# EasyEDA Pro project ProPrj_rrnje_2026-06-12.epro

# Schematic Schematic1
Board Name: Board1; Create Date: 2026-06-07; Page Name: P1; Project Name: cube; Schematic Name: Schematic1; Update Date: 2026-06-07; Company: EasyEDA.com; Page Size: A4; Version: V1.0
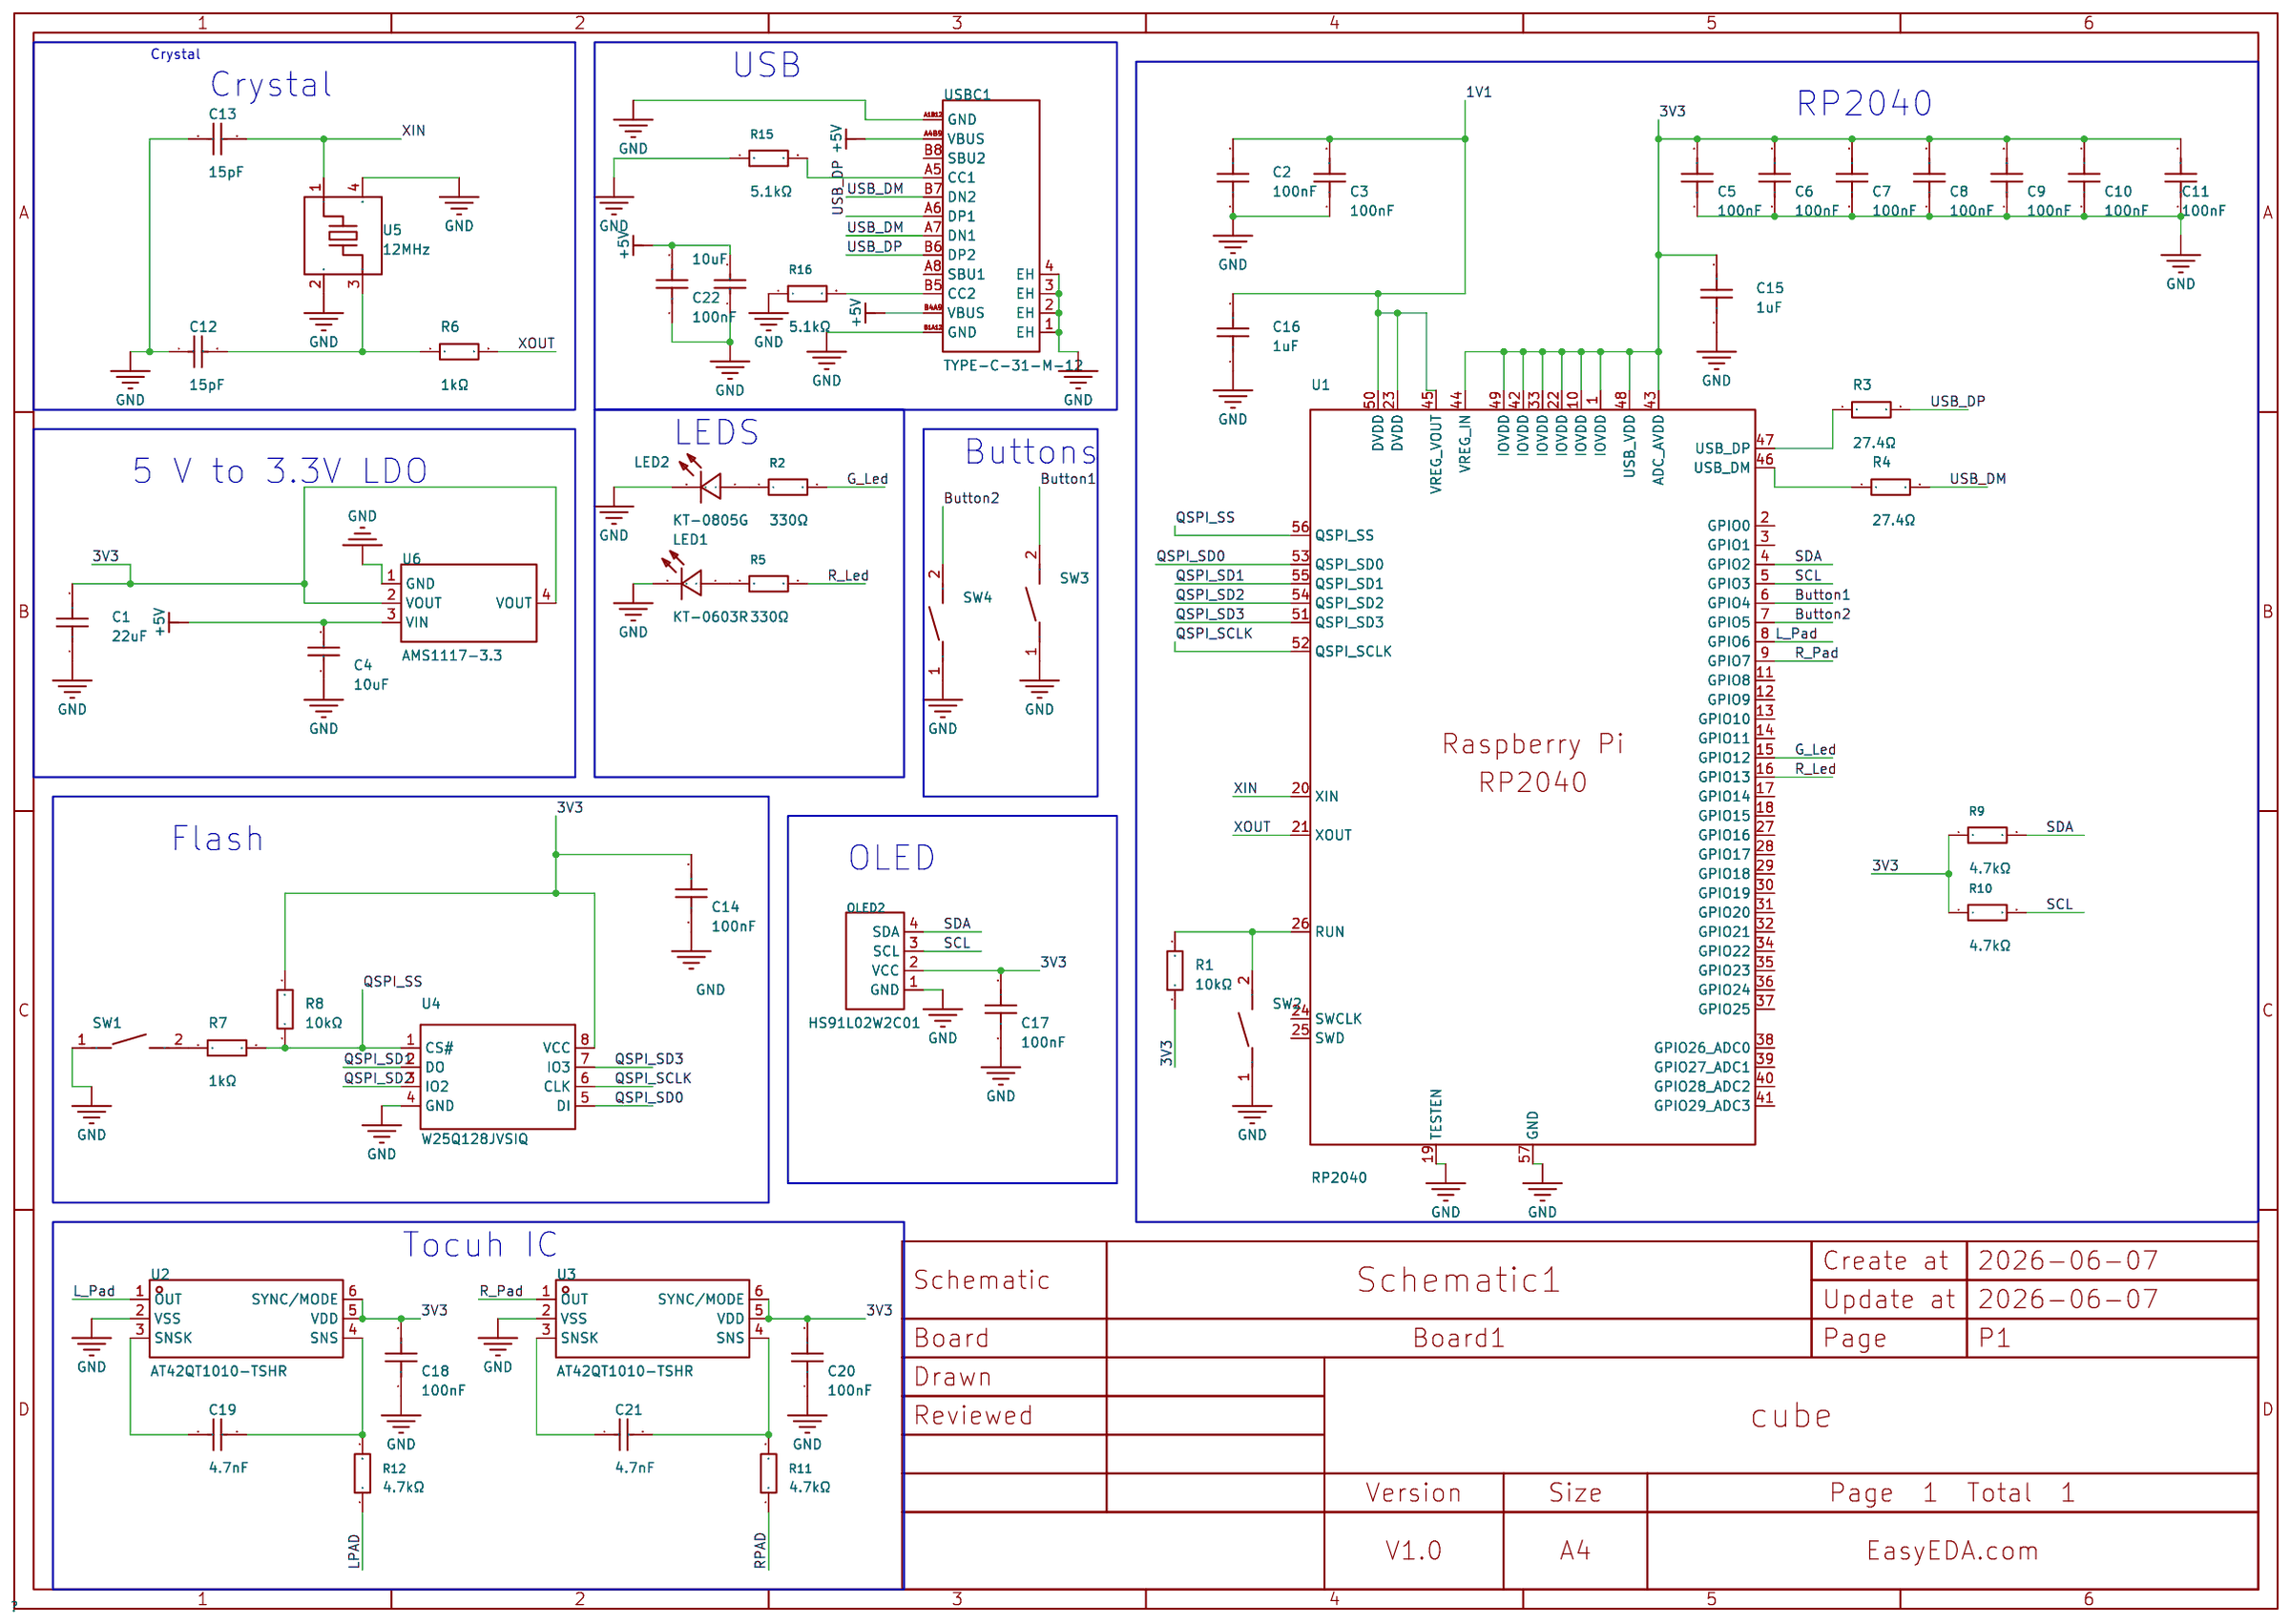
[diagram p0: schematic sheet]

## Parts
C1  22uF  [C0603]
C2  100nF  [C0402]
C3  100nF  [C0402]
C4  10uF  [C0402]
C5  100nF  [C0402]
C6  100nF  [C0402]
C7  100nF  [C0402]
C8  100nF  [C0402]
C9  100nF  [C0402]
C10  100nF  [C0402]
C11  100nF  [C0402]
C12  15pF  [C0402]
C13  15pF  [C0402]
C14  100nF  [C0402]
C15  1uF  [C0402]
C16  1uF  [C0402]
C17  100nF  [C0402]
C18  100nF  [C0402]
C19  4.7nF  [C0402]
C20  100nF  [C0402]
C21  4.7nF  [C0402]
C22  100nF  [C0402]
C23  10uF  [C0402]
LED1  KT-0603R  [LED-SMD_L1.6-W0.8-R-RD]
LED2  KT-0805G  [LED0805-R-RD]
OLED2  HS91L02W2C01  [OLED-TH_L38.0-W12.0_HS91L02W2C01]
R1  10kΩ  [R0402]
R2  330Ω  [R0402]
R3  27.4Ω  [R0402]
R4  27.4Ω  [R0402]
R5  330Ω  [R0402]
R6  1kΩ  [R0402]
R7  1kΩ  [R0402]
R8  10kΩ  [R0402]
R9  4.7kΩ  [R0402]
R10  4.7kΩ  [R0402]
R11  4.7kΩ  [R0402]
R12  4.7kΩ  [R0402]
R15  5.1kΩ  [R0402]
R16  5.1kΩ  [R0402]
SW1  TS-1088-AR02016  [SW-SMD_L3.9-W3.0-P4.45]
SW2  TS-1088-AR02016  [SW-SMD_L3.9-W3.0-P4.45]
SW3  TS-1088-AR02016  [SW-SMD_L3.9-W3.0-P4.45]
SW4  TS-1088-AR02016  [SW-SMD_L3.9-W3.0-P4.45]
U1  RP2040  [LQFN-56_L7.0-W7.0-P0.4-EP]
U2  AT42QT1010-TSHR  [SOT-23-6_L2.9-W1.6-P0.95-LS2.8-BR]
U3  AT42QT1010-TSHR  [SOT-23-6_L2.9-W1.6-P0.95-LS2.8-BR]
U4  W25Q128JVSIQ  [SOIC-8_L5.3-W5.3-P1.27-LS8.0-BL]
U5  12MHz  [CRYSTAL-SMD_4P-L3.2-W2.5-BL]
U6  AMS1117-3.3  [SOT-223-3_L6.5-W3.4-P2.30-LS7.0-BR]
USBC1  TYPE-C-31-M-12  [USB-C_SMD-TYPE-C-31-M-12_1]

## Library data of the parts
C1 = CL10A226MQ8NRNC: Capacitance:22uF Tolerance:±20% Tolerance:±20% Voltage Rating:6.3V Temperature Coefficient:X5R; LCSC Part Name: 22uF ±20% 6.3V; Supplier Part: C59461; Manufacturer: SAMSUNG(三星); Supplier Footprint: 0603; JLCPCB Part Class: Basic Part; Datasheet: https://item.szlcsc.com/datasheet/CL10A226MQ8NRNC/60514.html; Supplier: LCSC; Tolerance: ±20%; Voltage Rating: 6.3V; Temperature Coefficient: X5R
C2 C3 C5-C11 C14 C17 C18 C20 C22 = CL05B104KO5NNNC: Capacitance:100nF Tolerance:±10% Tolerance:±10% Voltage Rating:16V Temperature Coefficient:X7R; LCSC Part Name: 100nF ±10% 16V; Supplier Part: C1525; Manufacturer: SAMSUNG(三星); Supplier Footprint: 0402; JLCPCB Part Class: Basic Part; Datasheet: https://item.szlcsc.com/datasheet/CL05B104KO5NNNC/1877.html; Supplier: LCSC; Tolerance: ±10%; Voltage Rating: 16V; Temperature Coefficient: X7R
C4 C23 = CL05A106MQ5NUNC: Capacitance:10uF Tolerance:±20% Tolerance:±20% Voltage Rating:6.3V Temperature Coefficient:X5R; LCSC Part Name: 10uF ±20% 6.3V; Supplier Part: C15525; Manufacturer: SAMSUNG(三星); Supplier Footprint: 0402; JLCPCB Part Class: Basic Part; Datasheet: https://item.szlcsc.com/datasheet/CL05A106MQ5NUNC/16204.html; Supplier: LCSC; Tolerance: ±20%; Voltage Rating: 6.3V; Temperature Coefficient: X5R
C12 C13 = 0402CG150J500NT: Capacitance:15pF Tolerance:±5% Tolerance:±5% Voltage Rating:50V Temperature Coefficient:C0G; LCSC Part Name: 15pF ±5% 50V; Supplier Part: C1548; Manufacturer: FH(风华); Supplier Footprint: 0402; JLCPCB Part Class: Basic Part; Datasheet: https://item.szlcsc.com/datasheet/0402CG150J500NT/1900.html; Supplier: LCSC; Tolerance: ±5%; Voltage Rating: 50V; Temperature Coefficient: C0G
C15 C16 = CL05A105KA5NQNC: Capacitance:1uF Tolerance:±10% Tolerance:±10% Voltage Rating:25V Temperature Coefficient:X5R; LCSC Part Name: 1uF ±10% 25V; Supplier Part: C52923; Manufacturer: SAMSUNG(三星); Supplier Footprint: 0402; JLCPCB Part Class: Basic Part; Datasheet: https://item.szlcsc.com/datasheet/CL05A105KA5NQNC/53938.html; Supplier: LCSC; Tolerance: ±10%; Voltage Rating: 25V; Temperature Coefficient: X5R
C19 C21 = 0402B472K500NT: Capacitance:4.7nF Tolerance:±10% Tolerance:±10% Voltage Rating:50V Temperature Coefficient:X7R; LCSC Part Name: 4.7nF ±10% 50V; Supplier Part: C1538; Manufacturer: FH(风华); Supplier Footprint: 0402; JLCPCB Part Class: Basic Part; Datasheet: https://item.szlcsc.com/datasheet/0402B472K500NT/1890.html; Supplier: LCSC; Tolerance: ±10%; Voltage Rating: 50V; Temperature Coefficient: X7R
LED1 = KT-0603R: Lamp Holder Type:1.6mm x 0.8mm square LED Illumination Color:Red Voltage - Forward(Vf):1.8V~2.4V Voltage - Forward(Vf):1.8V~2.4V Power(Watts):40mW Forward Current:20mA Wavelength - Dominant:615nm~630nm Wavelength - Dominant:615nm~630nm Peak Wavelength:645; LCSC Part Name: 0603 红灯 高亮; Supplier Part: C2286; Manufacturer: KENTO; Supplier Footprint: 0603; JLCPCB Part Class: Basic Part; Datasheet: https://item.szlcsc.com/datasheet/KT-0603R/2659.html; Supplier: LCSC; Lamp Holder Type: 1.6mm x 0.8mm square LED; Illumination Color: Red; Voltage - Forward(Vf): 1.8V~2.4V; Power(Watts): 40mW; Forward Current: 20mA; Wavelength - Dominant: 615nm~630nm; Peak Wavelength: 645nm; Diode Configuration: Discrete Diode; Lens Color: Water Clear; Luminous Intensity: 300mcd; Viewing Angle: 120°; Operating Temperature: -40℃~+85℃
LED2 = KT-0805G: Lamp Holder Type:2mm x 1.25mm square LED Illumination Color:Emerald Green Voltage - Forward(Vf):2.6V~3.1V Voltage - Forward(Vf):2.6V~3.1V Power(Watts):100mW Forward Current:5mA Wavelength - Dominant:513nm~528nm Wavelength - Dominant:513nm~528nm Peak Wavel; LCSC Part Name: 0805 翠绿 高亮; Supplier Part: C2297; Manufacturer: KENTO; Supplier Footprint: 0805; JLCPCB Part Class: Basic Part; Datasheet: https://item.szlcsc.com/datasheet/KT-0805G/2670.html; Supplier: LCSC; Lamp Holder Type: 2mm x 1.25mm square LED; Illumination Color: Emerald Green; Voltage - Forward(Vf): 2.6V~3.1V; Power(Watts): 100mW; Forward Current: 5mA; Wavelength - Dominant: 513nm~528nm; Peak Wavelength: 525nm; Diode Configuration: Discrete Diode; Lens Color: Water Clear; Luminous Intensity: 430mcd; Viewing Angle: 120°; Operating Temperature: -40℃~+85℃
OLED2 = HS91L02W2C01: Controller Type:SSD1306 chip Interface:I2C Size:0.91 Dot Pixels:128x32 Operating Temperature:- Operating Temperature:- Type of Drive:Passive (PMOLED) Display Range:22.384x5.584mm Display Color:White Luminance:150cd/m2 Function:- Quiescent Current:- Voltag; LCSC Part Name: 0.91寸OLED显示屏白光IIC; Supplier Part: C5248081; Manufacturer: HS(汉昇); JLCPCB Part Class: Extended Part; Datasheet: https://item.szlcsc.com/datasheet/HS91L02W2C01/5960632.html; Supplier: LCSC; Controller Type: SSD1306 chip; Interface: I2C; Size: 0.91; Dot Pixels: 128x32; Type of Drive: Passive (PMOLED); Display Range: 22.384x5.584mm; Display Color: White; Luminance: 150cd/m2; Voltage - Supply  For Logic: 1.65V~3.3V
R1 R8 = 0402WGF1002TCE: Type:Thick Film Resistor Resistance:10kΩ Tolerance:±1% Tolerance:±1% Power(Watts):62.5mW Voltage-Supply(Max):50V Temperature Coefficient:±100ppm/℃ Temperature Coefficient:±100ppm/℃ Operating Temperature:-55℃~+155℃ Operating Temperature:-55℃~+155℃; LCSC Part Name: 10kΩ ±1% 62.5mW 厚膜电阻; Supplier Part: C25744; Manufacturer: UNI-ROYAL(厚声); Supplier Footprint: 0402; JLCPCB Part Class: Basic Part; Datasheet: https://item.szlcsc.com/datasheet/0402WGF1002TCE/26487.html; Supplier: LCSC; Type: Thick Film Resistor; Tolerance: ±1%; Power(Watts): 62.5mW; Voltage-Supply(Max): 50V; Temperature Coefficient: ±100ppm/℃; Operating Temperature: -55℃~+155℃
R2 R5 = 0402WGF3300TCE: Type:Thick Film Resistors Resistance:330Ω Tolerance:±1% Tolerance:±1% Power(Watts):1/16W Voltage-Supply(Max):50V Temperature Coefficient:±100ppm/℃ Temperature Coefficient:±100ppm/℃ Operating Temperature:-55℃~+155℃ Operating Temperature:-55℃~+155℃; LCSC Part Name: 330Ω ±1% 62.5mW 厚膜电阻; Supplier Part: C25104; Manufacturer: UNI-ROYAL(厚声); Supplier Footprint: 0402; JLCPCB Part Class: Basic Part; Datasheet: https://item.szlcsc.com/datasheet/0402WGF3300TCE/25847.html; Supplier: LCSC; Type: Thick Film Resistors; Tolerance: ±1%; Power(Watts): 1/16W; Voltage-Supply(Max): 50V; Temperature Coefficient: ±100ppm/℃; Operating Temperature: -55℃~+155℃
R3 R4 = WR04X27R4FTL: Type:Thick Film Resistor Resistance:27.4Ω Tolerance:±1% Tolerance:±1% Power(Watts):62.5mW Voltage-Supply(Max):50V Temperature Coefficient:±100ppm/℃ Temperature Coefficient:±100ppm/℃ Operating Temperature:-55℃~+155℃ Operating Temperature:-55℃~+155℃; LCSC Part Name: 厚膜电阻 27.4Ω ±1% 62.5mW; Supplier Part: C172043; Manufacturer: Walsin(华新科); Supplier Footprint: 0402; JLCPCB Part Class: Extended Part; Datasheet: https://item.szlcsc.com/datasheet/WR04X27R4FTL/183429.html; Supplier: LCSC; Type: Thick Film Resistor; Tolerance: ±1%; Power(Watts): 62.5mW; Voltage-Supply(Max): 50V; Temperature Coefficient: ±100ppm/℃; Operating Temperature: -55℃~+155℃
R6 R7 = 0402WGF1001TCE: Type:Thick Film Resistor Resistance:1kΩ Tolerance:±1% Tolerance:±1% Power(Watts):62.5mW Voltage-Supply(Max):50V Temperature Coefficient:±100ppm/℃ Temperature Coefficient:±100ppm/℃ Operating Temperature:-55℃~+155℃ Operating Temperature:-55℃~+155℃; LCSC Part Name: 1kΩ ±1% 62.5mW 厚膜电阻; Supplier Part: C11702; Manufacturer: UNI-ROYAL(厚声); Supplier Footprint: 0402; JLCPCB Part Class: Basic Part; Datasheet: https://item.szlcsc.com/datasheet/0402WGF1001TCE/12256.html; Supplier: LCSC; Type: Thick Film Resistor; Tolerance: ±1%; Power(Watts): 62.5mW; Voltage-Supply(Max): 50V; Temperature Coefficient: ±100ppm/℃; Operating Temperature: -55℃~+155℃
R9-R12 = 0402WGF4701TCE: Type:Thick Film Resistor Resistance:4.7kΩ Tolerance:±1% Tolerance:±1% Power(Watts):62.5mW Voltage-Supply(Max):50V Temperature Coefficient:±100ppm/℃ Temperature Coefficient:±100ppm/℃ Operating Temperature:-55℃~+155℃ Operating Temperature:-55℃~+155℃; LCSC Part Name: 4.7kΩ ±1% 62.5mW 厚膜电阻; Supplier Part: C25900; Manufacturer: UNI-ROYAL(厚声); Supplier Footprint: 0402; JLCPCB Part Class: Basic Part; Datasheet: https://item.szlcsc.com/datasheet/0402WGF4701TCE/26643.html; Supplier: LCSC; Type: Thick Film Resistor; Tolerance: ±1%; Power(Watts): 62.5mW; Voltage-Supply(Max): 50V; Temperature Coefficient: ±100ppm/℃; Operating Temperature: -55℃~+155℃
R15 R16 = 0402WGF5101TCE: Type:Thick Film Resistor Resistance:5.1kΩ Tolerance:±1% Tolerance:±1% Power(Watts):62.5mW Voltage-Supply(Max):50V Temperature Coefficient:±100ppm/℃ Temperature Coefficient:±100ppm/℃ Operating Temperature:-55℃~+155℃ Operating Temperature:-55℃~+155℃; LCSC Part Name: 5.1kΩ ±1% 62.5mW 厚膜电阻; Supplier Part: C25905; Manufacturer: UNI-ROYAL(厚声); Supplier Footprint: 0402; JLCPCB Part Class: Basic Part; Datasheet: https://item.szlcsc.com/datasheet/0402WGF5101TCE/26648.html; Supplier: LCSC; Type: Thick Film Resistor; Tolerance: ±1%; Power(Watts): 62.5mW; Voltage-Supply(Max): 50V; Temperature Coefficient: ±100ppm/℃; Operating Temperature: -55℃~+155℃
SW1-SW4 = TS-1088-AR02016: Circuit:SPST Actuator Style:Round Button Operating Force:1.6N Mounting Type:Surface Mount,Vertical Length:4mm Width:3mm Switch Height:2mm with Bracket:Without Bracket Contact Current:50mA Voltage Rating:12V Actuator/Cap Color:Black Termination Style:SMD(S; LCSC Part Name: 4*3*2mm 立贴 轻触开关; Supplier Part: C720477; Manufacturer: XUNPU(讯普); Supplier Footprint: SMD,4x3mm; JLCPCB Part Class: Basic Part; Datasheet: https://item.szlcsc.com/datasheet/TS-1088-AR02016/763484.html; Supplier: LCSC; Circuit: SPST; Actuator Style: Round Button; Operating Force: 1.6N; Mounting Type: Surface Mount,Vertical; Length: 4mm; Width: 3mm; Switch Height: 2mm; with Bracket: Without Bracket; Contact Current: 50mA; Voltage Rating: 12V; Actuator/Cap Color: Black; Termination Style: SMD(SMT) Tab; Life: 100,000 Cycles; Operating Temperature: -30℃~+80℃
U1 = RP2040_C2040: CPU Core:- CPU Maximum Speed:133MHz Number of I/O:30 ADC (Bit):12bit; LCSC Part Name: RP2040（RP2B2）; Supplier Part: C2040; Manufacturer: Raspberry Pi(树莓派); Supplier Footprint: LQFN-56(7x7); JLCPCB Part Class: Extended Part; Datasheet: https://item.szlcsc.com/datasheet/RP2040/2392.html; Supplier: LCSC; CPU Maximum Speed: 133MHz; Number of I/O: 30; ADC (Bit): 12bit
U2 U3 = AT42QT1010-TSHR: Number of Channels:1 Voltage - Supply:1.8V~5.5V Voltage - Supply:1.8V~5.5V Current - Supply:729uA Operating Temperature:-40℃~+85℃ Operating Temperature:-40℃~+85℃ Standby Current:16.5uA; LCSC Part Name: 数字突发模式电荷转移传感器，检测接近或触摸; Supplier Part: C74512; Manufacturer: MICROCHIP(美国微芯); Supplier Footprint: SOT-23-6; JLCPCB Part Class: Extended Part; Datasheet: https://item.szlcsc.com/datasheet/AT42QT1010-TSHR/75634.html; Supplier: LCSC; Number of Channels: 1; Voltage - Supply: 1.8V~5.5V; Current - Supply: 729uA; Operating Temperature: -40℃~+85℃; Standby Current: 16.5uA
U4 = W25Q128JVSIQ: Interface:SPI Memory Size:128Mbit Clock Frequency:133MHz Voltage - Supply:2.7V~3.6V Voltage - Supply:2.7V~3.6V Standby Supply Current:1uA Program / Erase Cycles:100,000 Cycles Page Programming Time (Tpp):3ms Block Erase Time(tBE):120ms@(32KB) Data Retenti; LCSC Part Name: 编带 支持双路/四路SPI接口的3V、128Mbit 串行闪存; Supplier Part: C97521; Manufacturer: Winbond(华邦); Supplier Footprint: SOIC-8-208mil; JLCPCB Part Class: Basic Part; Datasheet: https://item.szlcsc.com/datasheet/W25Q128JVSIQ/98729.html; Supplier: LCSC; Interface: SPI; Memory Size: 128Mbit; Clock Frequency: 133MHz; Voltage - Supply: 2.7V~3.6V; Standby Supply Current: 1uA; Program / Erase Cycles: 100,000 Cycles; Page Programming Time (Tpp): 3ms; Block Erase Time(tBE): 120ms@(32KB); Data Retention - TDR (Year): 20 Years; Operating Temperature: -40℃~+85℃
U5 = ABM8-272-T3_C20625731: Type:Crystal Oscillator Frequency:12MHz Normal temperature Frequency Tolerance:±30ppm Normal temperature Frequency Tolerance:±30ppm Load Capacitance:10pF Frequency Stability:±30ppm Frequency Stability:±30ppm Equivalent Series Resistance(ESR):50Ω Operating; LCSC Part Name: 12MHz ±30ppm 10pF; Supplier Part: C20625731; Manufacturer: ABRACON; Manufacturer Part: ABM8-272-T3; Supplier Footprint: SMD3225-4P; JLCPCB Part Class: Extended Part; Datasheet: https://item.szlcsc.com/datasheet/ABM8-272-T3/22032038.html; Supplier: LCSC; Type: Crystal Oscillator; Normal temperature Frequency Tolerance: ±30ppm; Load Capacitance: 10pF; Frequency Stability: ±30ppm; Equivalent Series Resistance(ESR): 50Ω; Operating Temperature: -40℃~+85℃
U6 = AMS1117-3.3_C6186: Output Configuration:Positive Voltage - Supply:15V Output Voltage:3.3V Output Voltage:3.3V Output Current:1A Power Supply Rejection Ratio (PSRR):72dB@(120Hz) Voltage Dropout:1.1V@(800mA) standby current:5mA Noise:0.003%Vout Features:Short Circuit Protecti; LCSC Part Name: 3.3V 1A 15V; Supplier Part: C6186; Manufacturer: Advanced Monolithic Systems; Supplier Footprint: SOT-223; JLCPCB Part Class: Basic Part; Datasheet: https://item.szlcsc.com/datasheet/AMS1117-3.3/6652.html; Supplier: LCSC; Output Configuration: Positive; Voltage - Supply: 15V; Output Voltage: 3.3V; Output Current: 1A; Power Supply Rejection Ratio (PSRR): 72dB@(120Hz); Voltage Dropout: 1.1V@(800mA); standby current: 5mA; Noise: 0.003%Vout; Features: Short Circuit Protection；Thermal shutdown；Over Current Protection; Operating Temperature: -40℃~+125℃; Output Type: Fixed; Number of Outputs: 1
USBC1 = TYPE-C-31-M-12: Connector Type:Type-C Protocol Standard:- Gender:Female Mounting Type:Surface Mount, Right Angle Number of Contacts:16P Number of Ports:1 Current Rating-Power:5A Voltage Rating:20V Connect-Disconnect Life:10,000 cycles Length:7.35mm Operating Temperature:; LCSC Part Name: Type-C 母 卧贴; Supplier Part: C165948; Manufacturer: 韩国韩荣; Supplier Footprint: SMD; JLCPCB Part Class: Extended Part; Datasheet: https://item.szlcsc.com/datasheet/TYPE-C-31-M-12/177331.html; Supplier: LCSC; Connector Type: Type-C; Gender: Female; Mounting Type: Surface Mount, Right Angle; Number of Contacts: 16P; Number of Ports: 1; Current Rating-Power: 5A; Voltage Rating: 20V; Connect-Disconnect Life: 10,000 cycles; Length: 7.35mm; Operating Temperature: -30℃~+80℃

## Nets
1V1: C2.2 C3.2 C16.2 U1.23(DVDD) U1.45(VREG_VOUT) U1.50(DVDD)
3V3: C1.2 C5.2 C6.2 C7.2 C8.2 C9.2 C10.2 C11.2 C14.2 C15.2 C17.2 C18.2 C20.2 OLED2.2(VCC) R1.1 R8.2 R9.1 R10.1 U1.1(IOVDD) U1.10(IOVDD) U1.22(IOVDD) U1.33(IOVDD) U1.42(IOVDD) U1.43(ADC_AVDD) U1.44(VREG_IN) U1.48(USB_VDD) U1.49(IOVDD) U2.5(VDD) U2.6(SYNC/MODE) U3.5(VDD) U3.6(SYNC/MODE) U4.8(VCC) U6.2(VOUT) U6.4(VOUT)
+5V: C4.2 C22.2 C23.2 U6.3(VIN) USBC1.A4B9(VBUS) USBC1.B4A9(VBUS)
GND: C1.1 C2.1 C3.1 C4.1 C5.1 C6.1 C7.1 C8.1 C9.1 C10.1 C11.1 C12.1 C13.1 C14.1 C15.1 C16.1 C17.1 C18.1 C20.1 C22.1 C23.1 LED1.2(K) LED2.2(K) OLED2.1(GND) R15.1 R16.1 SW1.1 SW2.1 SW3.1 SW4.1 U1.19(TESTEN) U1.57(GND) U2.2(VSS) U3.2(VSS) U4.4(GND) U5.2(GND) U5.4(GND) U6.1(GND) USBC1.1(EH) USBC1.2(EH) USBC1.3(EH) USBC1.4(EH) USBC1.A1B12(GND) USBC1.B1A12(GND)
Button1: SW3.2 U1.6(GPIO4)
Button2: SW4.2 U1.7(GPIO5)
G_Led: R2.2 U1.15(GPIO12)
L_Pad: U1.8(GPIO6) U2.1(OUT)
LPAD: R12.1
QSPI_SCLK: U1.52(QSPI_SCLK) U4.6(CLK)
QSPI_SD0: U1.53(QSPI_SD0) U4.5(DI)
QSPI_SD1: U1.55(QSPI_SD1) U4.2(DO)
QSPI_SD2: U1.54(QSPI_SD2) U4.3(IO2)
QSPI_SD3: U1.51(QSPI_SD3) U4.7(IO3)
QSPI_SS: R7.2 R8.1 U1.56(QSPI_SS) U4.1(CS#)
R_Led: R5.2 U1.16(GPIO13)
R_Pad: U1.9(GPIO7) U3.1(OUT)
RPAD: R11.1
SCL: OLED2.3(SCL) R10.2 U1.5(GPIO3)
SDA: OLED2.4(SDA) R9.2 U1.4(GPIO2)
USB_DM: R4.2 USBC1.A7(DN1) USBC1.B7(DN2)
USB_DP: R3.2 USBC1.A6(DP1) USBC1.B6(DP2)
XIN: C13.2 U1.20(XIN) U5.1
XOUT: R6.2 U1.21(XOUT)
$1N20: C12.2 R6.1 U5.3
$1N32: R15.2 USBC1.A5(CC1)
$1N33: R16.2 USBC1.B5(CC2)
$1N50: R3.1 U1.47(USB_DP)
$1N51: R4.1 U1.46(USB_DM)
$1N95: R1.2 SW2.2 U1.26(RUN)
$1N115: C19.1 U2.3(SNSK)
$1N116: C19.2 R12.2 U2.4(SNS)
$1N117: C21.2 R11.2 U3.4(SNS)
$1N118: C21.1 U3.3(SNSK)
$1N149: LED2.1(A) R2.1
$1N150: LED1.1(A) R5.1
$1N151: R7.1 SW1.2

Not connected (* = marked no-connect by the designer): U1 2(GPIO0) 3(GPIO1) 11(GPIO8) 12(GPIO9) 13(GPIO10) 14(GPIO11) 17(GPIO14) 18(GPIO15) 24(SWCLK) 25(SWD) 27(GPIO16) 28(GPIO17) 29(GPIO18) 30(GPIO19) 31(GPIO20) 32(GPIO21) 34(GPIO22) 35(GPIO23) 36(GPIO24) 37(GPIO25) 38(GPIO26_ADC0) 39(GPIO27_ADC1) 40(GPIO28_ADC2) 41(GPIO29_ADC3); USBC1 A8(SBU1) B8(SBU2)

## Notes on the sheet
- Crystal
- USB
- Crystal
- RP2040
- LEDS
- Buttons
- 5 V to 3.3V LDO
- Flash
- OLED
- Tocuh IC

# Board PCB1
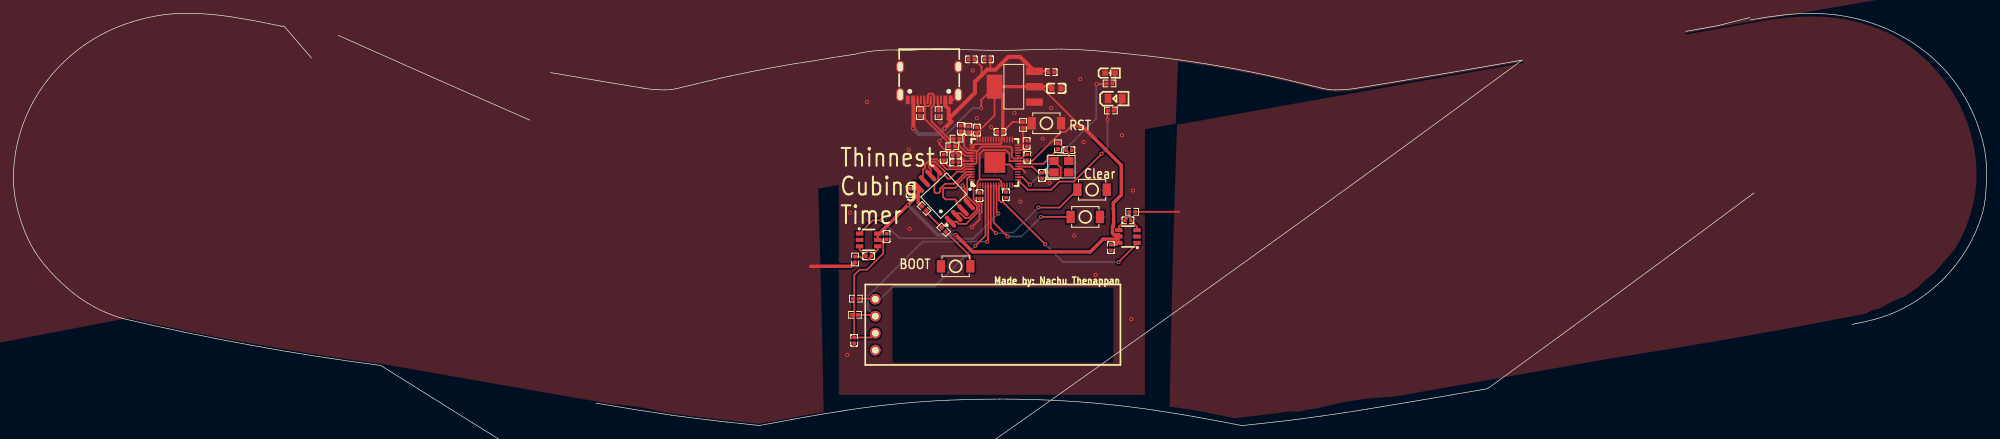
[diagram p1: board, top side]
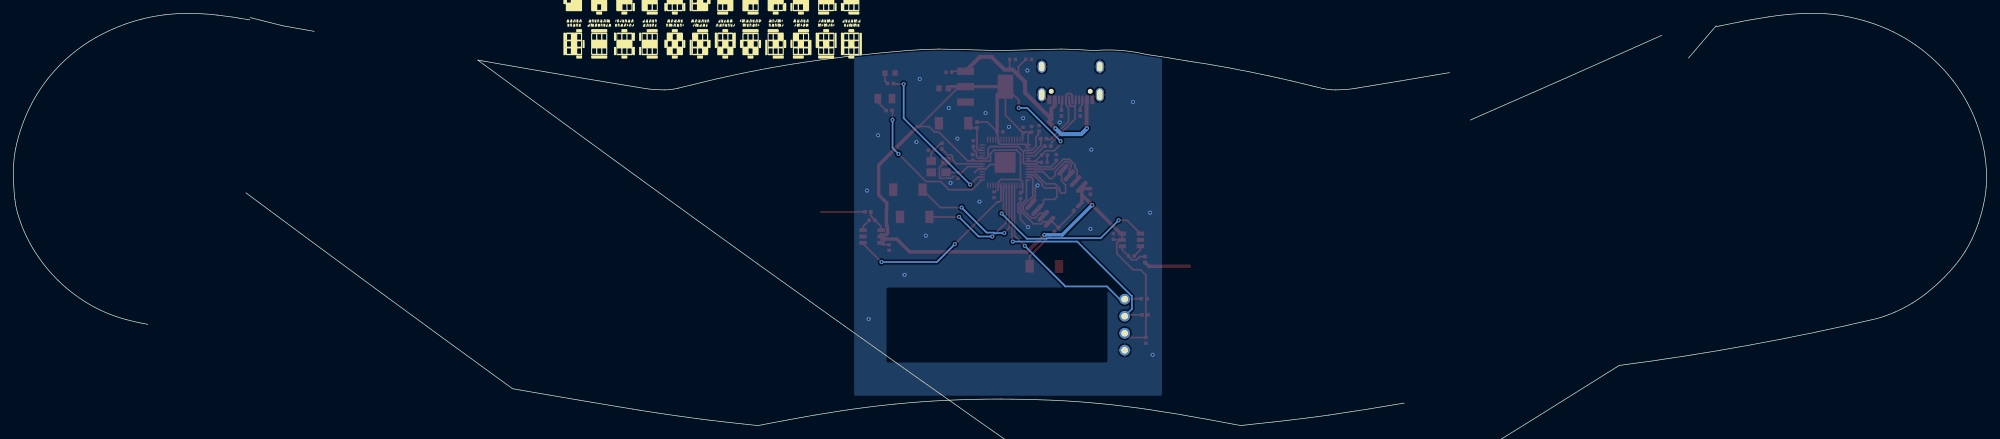
[diagram p2: board, bottom side, seen from below]

Outline 293.83 x 61.5 mm; copper layers: Top Layer, Bottom Layer. Coordinates in mm from the lower left corner of the outline.
Outline path: 0.03,38.13 arc(0.15,39.49) 0.34,40.84 arc(0.75,42.75) 1.32,44.61 arc(2.02,46.42) 2.87,48.16 arc(3.85,49.83) 4.97,51.41 arc(6.23,52.93) 7.6,54.34 arc(9.05,55.62) 10.58,56.78 arc(12.2,57.82) 13.89,58.73 arc(15.68,59.52) 17.53,60.19 arc(19.5,60.74) 21.5,61.16 arc(22.68,61.33) 23.87,61.43 arc(25.26,61.49) 26.64,61.49 arc(28.12,61.44) 29.6,61.33 arc(31.06,61.17) 32.52,60.96 arc(34.15,60.7) 35.77,60.42 arc(38.02,60.03) 40.28,59.64 arc(2006.89,-329.45) 48.37,58.22 arc(64.2,55.53) 79.99,52.65 arc(83.82,52) 87.65,51.35 arc(90.86,50.82) 94.08,50.29 arc(94.86,50.19) 95.64,50.12 arc(96.28,50.09) 96.92,50.08 arc(97.4,50.09) 97.88,50.13 arc(98.39,50.2) 98.91,50.31 arc(99.71,50.49) 100.52,50.69 arc(101.17,50.86) 101.82,51.01 arc(102.66,51.22) 103.5,51.41 arc(104.39,51.62) 105.27,51.82 arc(106.05,52) 106.84,52.17 arc(109.98,52.82) 113.13,53.43 arc(116.11,53.95) 119.11,54.41 arc(122.15,54.93) 125.21,55.39 arc(129.07,55.98) 132.99,55.94 arc(135.35,56.1) 137.72,56.17 arc(142.28,56.07) 146.84,55.94 arc(151.44,56.07) 156.04,56.17 arc(158.47,56.1) 160.89,55.94 arc(165.31,55.53) 169.72,55.05 arc(173.74,54.54) 177.74,53.95 arc(181.54,53.29) 185.34,52.55 arc(189.14,51.72) 192.92,50.8 arc(193.87,50.56) 194.82,50.34 arc(195.38,50.23) 195.94,50.14 arc(196.43,50.09) 196.92,50.08 arc(197.58,50.09) 198.24,50.12 arc(199.03,50.19) 199.81,50.3 arc(-43.04,1541.4) 206.78,51.45 arc(210.92,52.14) 215.06,52.85 arc(-71.83,1729.1) 224.67,54.53 arc(247.12,53.14) 249.05,58.82 arc(-107.06,2078.09) 253.75,59.65 arc(256.2,60.09) 258.65,60.53 arc(261.07,60.93) 263.51,61.24 arc(265.56,61.42) 267.61,61.49 arc(269.45,61.45) 271.28,61.29 arc(273.04,61.02) 274.79,60.63 arc(278.25,59.49) 281.53,57.91 arc(284.47,55.96) 287.1,53.6 arc(289.34,50.92) 291.17,47.95 arc(292.58,44.69) 293.53,41.27 arc(293.7,40.18) 293.8,39.08 arc(293.84,37.73) 293.82,36.37 arc(293.75,35.03) 293.62,33.7 arc(293.46,32.66) 293.2,31.63 arc(292.21,28.9) 290.88,26.32 arc(289.19,23.89) 287.22,21.69 arc(284.99,19.75) 282.54,18.1 arc(279.95,16.8) 277.21,15.86 arc(275.53,15.44) 273.83,15.1 arc(244.22,24.15) 219.51,5.5 arc(210.56,3.96) 201.61,2.46 arc(200.01,2.2) 198.4,1.95 arc(196.59,1.68) 194.78,1.42 arc(193.05,1.18) 191.32,0.95 arc(189.97,0.78) 188.63,0.63 182.96,0 179.18,0.72 arc(174.85,1.51) 170.51,2.21 arc(166.55,2.76) 162.59,3.21 arc(158.73,3.54) 154.87,3.77 arc(150.85,3.91) 146.82,3.96 arc(142.97,3.91) 139.12,3.79 arc(135.52,3.58) 131.93,3.28 arc(128.22,2.86) 124.51,2.36 arc(120.31,1.69) 116.11,0.95 111.05,0.01 106.33,0.52 arc(105.29,0.64) 104.25,0.76 arc(103.09,0.9) 101.93,1.04 arc(100.82,1.18) 99.71,1.32 arc(98.85,1.44) 97.99,1.56 arc(92.36,2.42) 86.74,3.35 arc(70.74,6.23) 54.71,8.97 arc(35.46,11.97) 16.38,15.95 arc(14.99,16.4) 13.64,16.93 arc(12.34,17.56) 11.08,18.27 arc(9.84,19.09) 8.65,19.99 arc(7.45,21.02) 6.31,22.11 arc(5.43,23.05) 4.59,24.03 arc(3.88,24.96) 3.22,25.93 arc(2.65,26.91) 2.13,27.93 arc(1.65,29.05) 1.23,30.18 arc(0.81,31.53) 0.47,32.91 arc(0.22,34.21) 0.07,35.52 arc(0.01,36.82) 0.03,38.13
Stack: Top Layer 0.035mm / Dielectric1 1.51mm FR4 er 4.5 / Bottom Layer 0.035mm

## Design rules (mm)
net $1N50: DP2
net USB_DP: DP1
net USB_DM: DP1
net $1N51: DP2
spacing copperThickness1oz (default): track to track 0.102, other pairs 0.152 to 0.3
spacing copperThickness2oz: track to track 0.203, other pairs 0.152 to 0.3
track width copperThickness1oz (default): min 0.127, default 0.254, max 2.54
track width copperThickness2oz: min 0.203, default 0.254, max 2.54
differential pair differentialPair (default): width min 0.127, default 0.254, max 2.54; gap min 0.152, default 0.152
net RPAD uses copperRegion
net R_PAD uses copperRegion
net GND uses copperRegion
net LPAD uses copperRegion
net L_PAD uses copperRegion

## Placement (name value [footprint] x y rotation side)
C1  22uF  [C0603]  155.3 50.31 180 top
C2  100nF  [C0402]  141.08 44.34 270 top
C3  100nF  [C0402]  138.54 40.02 270 top
C4  10uF  [C0402]  154.54 52.72 180 top
C5  100nF  [C0402]  143.49 44.08 270 top
C6  100nF  [C0402]  142.22 44.21 270 top
C7  100nF  [C0402]  146.92 43.83 0 top
C8  100nF  [C0402]  140.31 39.26 0 top
C9  100nF  [C0402]  150.98 40.02 270 top
C10  100nF  [C0402]  143.87 34.3 90 top
C11  100nF  [C0402]  147.81 34.43 90 top
C12  15pF  [C0402]  157.18 41.09 180 top
C13  15pF  [C0402]  153.18 37.31 90 top
C14  100nF  [C0402]  133.46 34.94 90 top
C15  1uF  [C0402]  140.28 40.35 0.9 top
C16  1uF  [C0402]  150.89 42.09 270 top
C17  100nF  [C0402]  125.2 12.71 90 top
C18  100nF  [C0402]  130.03 28.21 270 top
C19  4.7nF  [C0402]  127.36 25.29 0 top
C20  100nF  [C0402]  163.43 26.56 90 top
C21  4.7nF  [C0402]  165.97 30.62 180 top
C22  100nF  [C0402]  142.66 54.63 0 top
C23  10uF  [C0402]  145.06 54.63 0 top
LED1  KT-0603R  [LED-SMD_L1.6-W0.8-R-RD]  163.3 52.59 0 top
LED2  KT-0805G  [LED0805-R-RD]  164.06 48.78 0 top
OLED2  HS91L02W2C01  [OLED-TH_L38.0-W12.0_HS91L02W2C01]  128.35 15.05 0 top
R1  10kΩ  [R0402]  150.35 44.84 270 top
R2  330Ω  [R0402]  163.43 47 180 top
R3  27.4Ω  [R0402]  139.81 41.67 180 top
R4  27.4Ω  [R0402]  140.44 42.81 180 top
R5  330Ω  [R0402]  163.23 51.04 180 top
R6  1kΩ  [R0402]  155.55 41.67 270 top
R7  1kΩ  [R0402]  138.54 29.22 135 top
R8  10kΩ  [R0402]  135.61 32.4 135 top
R9  4.7kΩ  [R0402]  125.45 18.94 0 top
R10  4.7kΩ  [R0402]  125.33 16.52 0 top
R11  4.7kΩ  [R0402]  166.6 31.89 180 top
R12  4.7kΩ  [R0402]  125.33 24.78 90 top
R15  5.1kΩ  [R0402]  137.77 46.62 90 top
R16  5.1kΩ  [R0402]  134.98 46.62 90 top
SW1  TS-1088-AR02016  [SW-SMD_L3.9-W3.0-P4.45]  140.31 23.76 0 top
SW2  TS-1088-AR02016  [SW-SMD_L3.9-W3.0-P4.45]  153.83 45.1 180 top
SW3  TS-1088-AR02016  [SW-SMD_L3.9-W3.0-P4.45]  160.63 35.19 180 top
SW4  TS-1088-AR02016  [SW-SMD_L3.9-W3.0-P4.45]  159.62 31.13 180 top
U1  RP2040  [LQFN-56_L7.0-W7.0-P0.4-EP]  146.16 39.26 90 top
U2  AT42QT1010-TSHR  [SOT-23-6_L2.9-W1.6-P0.95-LS2.8-BR]  127.36 27.7 180 top
U3  AT42QT1010-TSHR  [SOT-23-6_L2.9-W1.6-P0.95-LS2.8-BR]  165.97 28.21 0 top
U4  W25Q128JVSIQ  [SOIC-8_L5.3-W5.3-P1.27-LS8.0-BL]  138.54 34.3 42.9 top
U5  12MHz  [CRYSTAL-SMD_4P-L3.2-W2.5-BL]  156.06 38.62 0 top
U6  AMS1117-3.3  [SOT-223-3_L6.5-W3.4-P2.30-LS7.0-BR]  149.08 50.56 0 top
USBC1  TYPE-C-31-M-12  [USB-C_SMD-TYPE-C-31-M-12_1]  136.38 51.07 180 top

## Footprints (pads in the part's own frame, mm; a bottom-side part is the same pattern mirrored in y, then rotated)
C0402
  rect 0.5x0.54 smd: 1(-0.42,0) 2(0.42,0)
C0603
  rect 0.8x0.9 smd: 1(-0.7,0) 2(0.7,0)
CRYSTAL-SMD_4P-L3.2-W2.5-BL
  rect 1.4x1.2 smd: 1(-1.1,-0.85) 2(1.1,-0.85) 3(1.1,0.85) 4(-1.1,0.85)
LED0805-R-RD
  rect 1x1.399 smd: 1(1.05,0) 2(-1.05,0)
LED-SMD_L1.6-W0.8-R-RD
  rect 0.8x0.8 smd: 1(0.75,0) 2(-0.75,0)
LQFN-56_L7.0-W7.0-P0.4-EP
  rect 0.85x0.2 smd: 1(-3.425,2.6) 2(-3.425,2.2) 3(-3.425,1.8) 4(-3.425,1.4) 5(-3.425,1) 6(-3.425,0.6) 7(-3.425,0.2) 8(-3.425,-0.2) 9(-3.425,-0.6) 10(-3.425,-1) 11(-3.425,-1.4) 12(-3.425,-1.8) 13(-3.425,-2.2) 14(-3.425,-2.6) 29(3.425,-2.6) 30(3.425,-2.2) 31(3.425,-1.8) 32(3.425,-1.4) 33(3.425,-1) 34(3.425,-0.6) 35(3.425,-0.2) 36(3.425,0.2) 37(3.425,0.6) 38(3.425,1) 39(3.425,1.4) 40(3.425,1.8) 41(3.425,2.2) 42(3.425,2.6)
  rect 0.2x0.85 smd: 15(-2.6,-3.425) 16(-2.2,-3.425) 17(-1.8,-3.425) 18(-1.4,-3.425) 19(-1,-3.425) 20(-0.6,-3.425) 21(-0.2,-3.425) 22(0.2,-3.425) 23(0.6,-3.425) 24(1,-3.425) 25(1.4,-3.425) 26(1.8,-3.425) 27(2.2,-3.425) 28(2.6,-3.425) 43(2.6,3.425) 44(2.2,3.425) 45(1.8,3.425) 46(1.4,3.425) 47(1,3.425) 48(0.6,3.425) 49(0.2,3.425) 50(-0.2,3.425) 51(-0.6,3.425) 52(-1,3.425) 53(-1.4,3.425) 54(-1.8,3.425) 55(-2.2,3.425) 56(-2.6,3.425)
  rect 3.1x3.1 smd: 57(0,0)
OLED-TH_L38.0-W12.0_HS91L02W2C01
  round 1.6 hole 1: 1(0,-3.81) 2(0,-1.27) 3(0,1.27) 4(0,3.81)
R0402
  rect 0.566x0.54 smd: 1(-0.433,0) 2(0.433,0)
SOIC-8_L5.3-W5.3-P1.27-LS8.0-BL
  oval 0.63x2.25 smd: 1(-1.905,-3.53) 2(-0.635,-3.53) 3(0.635,-3.53) 4(1.905,-3.53) 5(1.905,3.53) 6(0.635,3.53) 7(-0.635,3.53) 8(-1.905,3.53)
SOT-23-6_L2.9-W1.6-P0.95-LS2.8-BR
  rect 1.1x0.6 smd: 1(1.35,-0.95) 2(1.35,0) 3(1.35,0.95) 4(-1.35,0.95) 5(-1.35,0) 6(-1.35,-0.95)
SOT-223-3_L6.5-W3.4-P2.30-LS7.0-BR
  rect 2.5x1.1 smd: 1(2.97,-2.3) 2(2.97,0) 3(2.97,2.3)
  rect 2.34x3.6 smd: 4(-2.97,0)
SW-SMD_L3.9-W3.0-P4.45
  rect 1.23x1.86 smd: 1(-2.185,0) 2(2.185,0)
USB-C_SMD-TYPE-C-31-M-12_1
  oval 1.2x2 hole 0.8x1.6: 1(4.325,1.706) 4(-4.325,1.706)
  oval 1.2x1.8 hole 0.8x1.4: 2(4.325,-2.474) 3(-4.325,-2.474)
  custom 0.6x1.3 smd: A1B12(-3.2,2.474) A4B9(-2.4,2.474) B1A12(3.2,2.474) B4A9(2.401,2.474)
  rect 0.3x1.3 smd: A5(-1.25,2.474) A6(-0.25,2.474) A7(0.25,2.474) A8(1.25,2.474) B5(1.75,2.474) B6(0.75,2.474) B7(-0.75,2.474) B8(-1.75,2.474)

## Nets
As in the schematic.

Pads without a net: U1 2 3 11 12 13 14 17 18 24 25 27 28 29 30 31 32 34 35 36 37 38 39 40 41; USBC1 A8 B8

## Via types
v1: diameter 0.61, hole 0.305, Top Layer to Bottom Layer, 43 vias

## Routing (per net, layer and track width the routed paths; a pad name or vN(x,y) marks a point on that pad's centre or on a via; arc(x,y) is an arc through that point)
1V1: length 23.2
  Top Layer w0.254: 143.27,39.06 U1.50 ; U1.50 142.71,39.04 141.57,39.04 141.15,38.63 139.3,38.63 138.43,39.5 C3.2 ; U1.50 142.76,39.08 143.27,39.08 143.44,39.25 143.44,40.86 ; C16.2 150.9,41.17 150.7,40.97 150.6,40.97 150.44,40.81 150.44,40.19 150.13,39.88 149.61,39.88 U1.23 149.56,39.84 148.96,39.84 148.7,40.1 148.7,41.29 148.37,41.63 144.21,41.63 143.44,40.86 ; 141.21,43.92 141.21,43.43 141.57,43.08 141.57,41.71 142.19,41.08 142.71,41.08 U1.45 142.76,41.04 143.27,41.04 143.44,40.88 143.44,40.86
3V3: length 190.1
  Top Layer w0.254: C6.2 142.35,43.79 ; 142.35,43.79 143.37,43.79 C5.2 143.8,43.98 143.88,43.98 144.04,44.14 144.04,44.22 146.11,46.28 U6.4 144.13,48.58 v1(144.13,47.39) ; 142.35,43.79 142.73,43.41 U1.43 ; 143.83,34.56 143.56,34.84 U1.1 143.58,35.86 143.58,36.38 143.92,36.72 146.79,36.72 147.14,36.38 147.14,35.86 U1.10 147.18,35.81 147.18,35.3 147.43,35.05 ; 141.69,39.44 142.71,39.44 142.73,39.46 U1.48 ; 141.69,39.44 141.46,39.44 141.28,39.26 140.74,39.26 ; 141.69,39.44 140.77,40.36 C15.2 140.4,40.67 140.4,40.73 140.13,41 138.85,41 137.9,41.94 v1(137.9,42.44) ; U3.5 U3.6 164.34,26.98 C20.2 ; C18.2 129.94,27.7 129.01,27.7 ; 143.34,43.72 143.56,43.5 U1.42 ; 153.02,50.56 158.96,44.62 157.47,44.62 156.68,43.83 156.06,43.83 151.71,39.48 150.86,39.48 ; R1.1 148.79,45.28 C7.2 147.34,43.39 147.18,43.23 147.18,42.71 U1.33 147.14,42.66 147.14,42.15 146.98,41.98 143.26,41.98 142.73,41.46 ; 150.86,39.48 C9.2 ; 150.86,39.48 150.84,39.46 148.34,39.46 148.34,40.57 147.82,41.09 144.61,41.09 arc(144.6,41.09) 144.59,41.09 144.51,41.17 143.87,40.53 143.87,36.67 ; 129.01,27.7 U2.5 U2.6 ; 129.01,27.7 129.54,27.17 129.54,25.69 127.11,23.26 126.01,23.26 125.2,22.45 125.2,16.14 125.2,16.14 C17.2 127.71,13.14 OLED2.2
  Top Layer w0.5: 158.96,44.62 159.22,44.62 164.99,38.85 164.99,34.41 163.79,33.21 163.79,32.28 163.84,32.23 163.84,30.04 163.79,29.99 163.79,29.75 163.67,29.63 163.67,28.7 163.9,28.46 164.62,28.46 U3.5 164.24,27.83 162.29,27.83 160.38,25.93 142.86,25.93 v1(140.32,28.47) ; 134.74,34.45 v1(133.21,32.91) 128.71,28.42 ; 134.74,34.45 U4.8 134.51,35.36 C14.2 ; 134.74,34.45 134.74,33.28 135.31,32.71 ; C7.2 147.34,49.33 U6.4 U6.2 ; 153.02,50.56 154.35,50.56 154.6,50.31
  Bottom Layer w0.254: v1(144.12,47.38) 142.85,47.38 v1(137.9,42.43)
  Bottom Layer w0.5: v1(140.32,28.47) 137.65,28.47 v1(133.21,32.91)
+5V: length 39.7
  Top Layer w0.254: 144.18,52.27 144.18,53.54 C22.2 ; 145.53,53.1 145.48,53.15 C23.2 ; U6.3 153.98,52.86 C4.2
  Top Layer w0.6: v1(133.98,44.34) 134.03,44.39 134.03,48.55 USBC1.B4A9 ; 139.28,45.75 143.19,49.65 143.19,51.27 145.02,53.1 146.26,53.1 148.16,55.01 149.91,55.01 U6.3 ; 139.28,45.75 139.28,47.25 138.78,47.75 USBC1.A4B9 ; 139.28,45.75 139.68,45.35 v1(138.67,44.34)
  Bottom Layer w0.6: v1(133.98,44.34) 134.83,43.48 137.8,43.48 v1(138.66,44.34)
GND: length 21.1
  Top Layer w0.254: USBC1.4 139.94,48.6 USBC1.A1B12 ; C10.1 143.87,33.37 144.2,33.05 144.2,31.89 143.87,31.56 143.87,30.75 v1(142.73,29.61) ; C15.1 139.9,40.32 C8.1 ; U4.4 142.34,33.4 141.67,34.06 141.67,35.49 v1(141.33,35.83) ; U1.57 146.79,39.26 147.09,38.96 148.36,38.96 149.04,38.28 149.56,38.28 U1.19 150.21,38.26 150.73,37.74 ; 153.84,37.21 154.15,36.9 155.78,36.9 155.94,37.06 155.94,38.49 154.97,39.47 U5.4
  vias: v1(124.18,10.55) v1(124.57,31.76) v1(127.11,48.27) v1(133.33,41.16) v1(133.46,29.35) v1(138.03,45.23) v1(142.85,52.97) v1(143.49,45.86) v1(145.59,44.55) v1(149.08,46.62) v1(149.97,33.41) v1(153.27,42.81) v1(154.28,36.21) v1(154.54,47.38) v1(157.97,28.33) v1(158.86,51.7) v1(159.36,42.3) v1(161.14,22.49) v1(165.08,43.32) v1(166.48,15.89) v1(166.73,35.07)
Button1: length 22.3
  Top Layer w0.254: v1(146.29,28.72) 145.54,29.47 145.54,35.81 U1.6 ; v1(152.64,32.53) 155.79,32.53 SW3.2
  Bottom Layer w0.254: v1(146.28,28.72) 147.74,28.72 147.82,28.79 148.9,28.79 v1(152.63,32.53)
BUTTON2: length 8.5
  Top Layer w0.254: 148.06,28.21 145.98,30.29 145.98,35.81 145.96,35.83
Button2: length 10.6
  Top Layer w0.254: v1(153.01,31.13) SW4.2
  Bottom Layer w0.254: v1(148.06,28.21) 150.1,28.21 v1(153.02,31.13)
G_LED: length 4.9
  Top Layer w0.254: 162.99,47 162.92,46.93 162.92,45.61 ; 154.54,35.19 151.04,35.19
G_Led: length 17.2
  Top Layer w0.254: 154.54,35.2 155.75,36.41 157.91,36.41 v1(162.03,40.53) ; 149.58,36.66 151.05,35.2
  Bottom Layer w0.254: v1(162.03,40.53) 162.92,41.42 v1(162.92,45.61)
L_PAD: length 11.4
  Top Layer w0.254: 146.41,35.26 146.38,35.29 146.38,35.81 146.36,35.83 ; 127.98,30.62 126.01,28.65
  Bottom Layer w0.254: 140,27.95 131.93,27.95
L_Pad: length 17.1
  Top Layer w0.254: v1(129.27,30.62) 127.98,30.62 ; v1(146.67,31.64) 146.59,31.64 146.41,31.82 146.41,35.26
  Bottom Layer w0.254: 131.94,27.96 v1(129.27,30.62) ; v1(146.67,31.64) 142.91,27.88 140.08,27.88 140,27.96
LPAD: length 6.8
  Top Layer w0.5: 118.73,23.77 124.75,23.77 R12.1
QSPI_SCLK: length 10.3
  Top Layer w0.254: U1.52 141.79,38.26 141.42,37.88 140.54,37.88 139.5,36.84 139.18,36.84 138.67,37.35 138.67,37.92 137.22,39.37 136.73,39.37 136.38,39.03 136.38,38.45 136.6,38.23 U4.6
QSPI_SD0: length 10.9
  Top Layer w0.254: U4.5 137.75,37.97 137.75,36.49 137.14,35.88 137.14,34.87 137.32,34.69 137.78,34.69 138.03,34.94 138.03,35.37 138.74,36.08 140.12,36.08 141.88,37.84 142.71,37.84 U1.53
QSPI_SD1: length 10.8
  Top Layer w0.254: U4.2 140.08,31.68 141,31.68 141.71,30.96 142.27,30.96 143.48,32.18 143.48,32.75 142.03,34.21 142.03,36.87 142.19,37.04 142.28,37.04 142.3,37.06 U1.55
QSPI_SD2: length 10.6
  Top Layer w0.254: 142.73,37.46 142.71,37.44 141.98,37.44 140.69,36.15 140.69,35.88 140.26,35.46 138.62,35.46 138.44,35.28 138.44,34.11 138.8,33.75 140.26,33.75 140.44,33.57 140.44,33.12 U4.3
QSPI_SD3: length 10.9
  Top Layer w0.254: 142.73,38.66 141.69,38.66 141.27,38.24 138.98,38.24 137.49,39.73 136.58,39.73 135.74,38.89 135.74,38.45 135.45,38.16 135.45,36.46 U4.7
QSPI_SS: length 15.5
  Top Layer w0.254: R8.1 135.92,31.84 138.23,29.53 139.12,30.43 U4.1 140.46,30.43 140.78,30.1 141.91,30.1 143.84,32.03 143.84,32.9 142.98,33.76 142.98,36.41 142.73,36.66
R_LED: length 1.6
  Top Layer w0.254: 162.8,51.04 162.7,50.94 161.27,50.94
R_Led: length 21.3
  Top Layer w0.254: v1(151.37,35.96) 150.26,37.06 U1.16
  Bottom Layer w0.254: v1(161.27,50.94) 161.27,45.86 v1(151.36,35.95)
R_PAD: length 4
  Top Layer w0.254: 167.32,27.26 167.32,27.15 164.57,24.4
R_Pad: length 23.8
  Top Layer w0.254: U1.9 146.76,35.42 146.77,35.41 146.77,33.63 147.04,33.36 147.36,33.36 v1(153.65,27.07)
  Bottom Layer w0.254: v1(153.65,27.07) 156.32,24.4 v1(164.57,24.4)
RPAD: length 6.6
  Top Layer w0.254: R11.1 173.59,31.89
SCL: length 35.7
  Top Layer w0.254: v1(145.02,27.45) 145.02,27.58 145.16,27.72 U1.5 ; OLED2.3 128.15,16.53 R10.2
  Bottom Layer w0.254: OLED2.3 127.28,17.4 127.28,19.31 135.42,27.45 v1(145.02,27.45)
SDA: length 30.3
  Top Layer w0.254: v1(143.24,26.81) 144.76,28.34 U1.4 ; R9.2 128.28,18.94 OLED2.4
  Bottom Layer w0.254: OLED2.4 129.09,18.86 130.99,20.76 137.18,20.76 v1(143.23,26.81)
USB_DM: length 10.4
  Top Layer w0.254: 140.13,42.69 139.41,42.69 136.71,45.38 136.71,47.41 136.96,47.66 136.96,47.73 137.06,47.83 137.06,49.36 136.89,49.52 136.36,49.52 136.2,49.36 136.2,48.74 136.15,48.69 136.15,48.62 USBC1.A7
USB_DP: length 10.2
  Top Layer w0.254: USBC1.A6 136.56,48.53 136.56,47.83 136.4,47.67 135.86,47.67 ; 135.86,47.67 135.75,47.55 135.75,45.74 139.25,42.23 139.25,41.55 ; 135.86,47.67 135.7,47.83 135.7,48.53 USBC1.B6
XIN: length 5.8
  Top Layer w0.254: 149.58,38.66 149.61,38.64 151.73,38.64 152.64,37.74 C13.2 153.22,37.78 U5.1
XOUT: length 7.2
  Top Layer w0.254: R6.2 154.67,40.35 154.15,40.35 153.99,40.19 153.99,39.67 153.38,39.06 U1.21
$1N20: length 3.4
  Top Layer w0.254: U5.3 157.16,40.61 157.07,40.7 157.07,40.78 155.75,42.1 R6.1
$1N32: length 1.6
  Top Layer w0.254: USBC1.A5 137.7,48.52 137.7,47.83 137.77,47.75 R15.2
$1N33: length 1.7
  Top Layer w0.254: R16.2 134.98,47.55 134.7,47.83 134.7,48.53 USBC1.B5
$1N50: length 3.2
  Top Layer w0.254: 140.12,41.55 140.44,41.55 141.74,40.25 142.73,40.25
$1N51: length 3.3
  Top Layer w0.254: 142.73,40.66 142.3,40.66 142.28,40.68 141.94,40.68 140.83,41.8 140.83,42.51 141,42.69
$1N95: length 5.6
  Top Layer w0.254: U1.26 149.61,41.08 150.13,41.08 150.35,41.3 150.35,42.88 150.35,42.88 R1.2 150.96,44.42 SW2.2
$1N115: length 1.8
  Top Layer w0.254: U2.3 126.01,26.22 126.94,25.29
$1N116: length 4.8
  Top Layer w0.254: R12.2 126.1,25.22 126.58,24.74 127.31,24.74 127.47,24.91 127.47,24.98 C19.2 128.71,26.22 U2.4
$1N117: length 3.4
  Top Layer w0.254: R11.2 166.17,31.32 165.86,31.01 165.86,30.93 164.62,29.69 U3.4
$1N118: length 1.8
  Top Layer w0.254: U3.3 167.32,29.69 C21.1
$1N149: length 2.3
  Top Layer w0.254: LED2.1 165.11,48.26 R2.1
$1N150: length 1.7
  Top Layer w0.254: R5.1 164.05,51.44 LED1.1
$1N151: length 6.7
  Top Layer w0.254: R7.1 142.5,25.26 SW1.2

## Copper pours and planes (outline as drawn; the poured copper is in the pictures)
GND on Top Layer: 122.91,62.88 168.51,62.88 168.51,4.59 122.91,4.59
GND on Bottom Layer: 122.79,58.69 168.63,58.69 168.63,4.46 122.79,4.46
LPAD on Top Layer: 118.29,1.57 115.93,1.18 110.85,0.14 107.61,0.51 104.38,0.9 102.55,1.18 101.23,1.13 99.93,1.41 99.04,1.54 98.15,1.67 92.78,2.82 87.31,3.32 1681.64,-895.16 55.01,9.03 35.84,12.19 16.75,15.76 15.71,16.23 14.61,16.5 13,17.43 11.29,18.18 10.08,18.89 8.92,19.68 7.79,20.78 6.57,21.76 5.69,22.74 4.85,23.75 4.05,24.62 3.3,25.54 2.72,26.53 2.21,27.55 1.73,28.66 1.31,29.8 0.89,31.15 0.54,32.52 0.3,33.82 0.15,35.13 0.08,36.44 0.11,37.74 0.22,39.1 0.42,40.46 0.83,42.36 1.39,44.23 2.1,46.03 2.94,47.77 3.93,49.44 5.05,51.03 6.31,52.54 7.68,53.96 9.12,55.23 10.66,56.39 12.28,57.43 13.97,58.34 15.74,59.18 17.6,59.8 19.57,60.35 21.58,60.77 22.76,60.95 23.95,61.05 25.34,61.1 26.72,61.1 28.2,61.05 29.67,60.95 31.14,60.79 32.6,60.58 34.22,60.31 35.85,60.04 40.35,59.25 2006.97,-329.84 48.45,57.83 -1338.39,-780.92 80.06,52.27 83.9,51.61 87.73,50.97 90.94,50.44 94.16,49.91 94.93,49.8 95.71,49.74 96.36,49.71 97,49.69 97.48,49.7 97.95,49.74 98.47,49.82 98.99,49.92 99.79,50.11 100.59,50.31 101.9,50.63 103.58,51.03 105.34,51.43 106.92,51.78 110.06,52.44 113.21,53.04 116.19,53.56 119.19,54.02 -433.55,-109.48 120.66,1.89
RPAD on Top Layer: 174.35,2.33 176.71,1.93 181.78,0.9 185.02,1.27 188.26,1.66 190.09,1.93 191.41,1.89 192.71,2.17 193.6,2.29 194.49,2.42 199.86,3.57 205.33,4.07 -1389,-894.41 237.63,9.79 256.8,12.95 275.89,16.52 276.92,16.99 278.03,17.25 279.64,18.19 281.35,18.93 282.56,19.65 283.72,20.44 284.84,21.54 286.07,22.52 286.95,23.49 287.79,24.51 288.59,25.38 289.34,26.3 289.91,27.29 290.43,28.31 290.91,29.42 291.33,30.55 291.75,31.91 292.09,33.28 292.34,34.58 292.49,35.89 292.55,37.19 292.53,38.5 292.41,39.86 292.22,41.21 291.81,43.12 291.25,44.98 290.54,46.79 289.69,48.53 288.71,50.2 287.59,51.79 286.33,53.3 284.96,54.71 283.51,55.99 281.98,57.15 280.36,58.19 278.67,59.1 276.9,59.94 275.04,60.56 273.06,61.11 271.06,61.53 269.88,61.7 268.69,61.81 267.3,61.86 265.92,61.86 264.44,61.81 262.96,61.7 261.5,61.55 260.04,61.34 258.41,61.07 256.79,60.79 252.28,60.01 -1714.33,-329.08 244.19,58.59 1631.03,-780.16 212.57,53.03 208.74,52.37 204.91,51.73 201.7,51.19 198.48,50.67 197.7,50.56 196.92,50.49 196.28,50.46 195.64,50.45 195.16,50.46 194.69,50.5 194.17,50.58 193.65,50.68 192.85,50.86 192.04,51.06 190.74,51.39 189.06,51.79 187.29,52.19 185.72,52.54 182.58,53.2 179.43,53.8 176.45,54.32 173.45,54.78 726.19,-108.72 171.98,2.65

## Text on the board
Top Silkscreen Layer: Made by: Nachu Thenappan | BOOT | RST | Clear | Thinnest / Cubing / Timer
